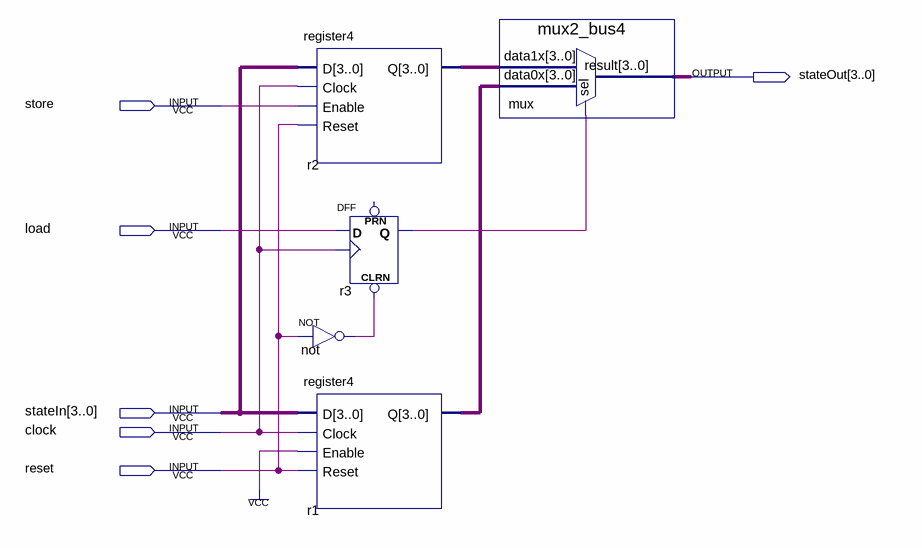
[diagram p0: schematic sheet]
// Quartus schematic state_register.bdf as structural Verilog: 5 symbols, 6 pins
module state_register (
  input  store,
  input  load,
  input  [3:0] stateIn,
  input  clock,
  input  reset,
  output [3:0] stateOut
);

  wire not_out, r3_q;
  wire [3:0] r1_q, r2_q;

  register4 r2 (.D(stateIn), .Clock(clock), .Enable(store), .Reset(reset), .Q(r2_q));
  not \not  (not_out, reset);
  register4 r1 (.D(stateIn), .Clock(clock), .Enable(1'b1), .Reset(reset), .Q(r1_q));
  DFF r3 (.CLRN(not_out), .CLK(clock), .D(load), .Q(r3_q));  // open: PRN
  mux2_bus4 mux (.data1x(r2_q), .data0x(r1_q), .sel(r3_q), .result(stateOut));
endmodule
